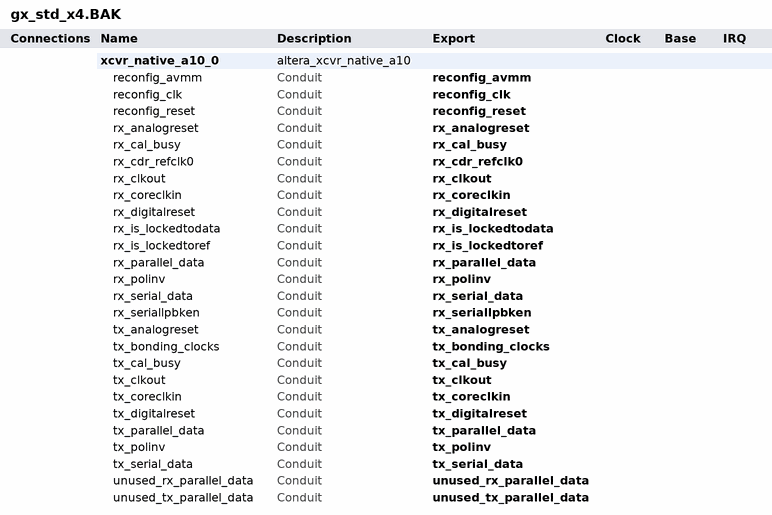
[diagram p0: system contents]
# Platform Designer (Qsys) system gx_std_x4.BAK, Arria 10 10AX115S4F45I3SGE2
# Parameters at their usual value, and those the tool derives, are not listed.
package require -exact qsys 15.1
create_system gx_std_x4.BAK
set_project_property DEVICE_FAMILY {Arria 10}
set_project_property DEVICE 10AX115S4F45I3SGE2

add_instance xcvr_native_a10_0 altera_xcvr_native_a10 15.1
set_instance_property xcvr_native_a10_0 AUTO_EXPORT true
set_instance_parameter_value xcvr_native_a10_0 anlg_voltage 1_1V
set_instance_parameter_value xcvr_native_a10_0 base_device NIGHTFURY5
set_instance_parameter_value xcvr_native_a10_0 bonded_mode pma_pcs
set_instance_parameter_value xcvr_native_a10_0 channels 4
set_instance_parameter_value xcvr_native_a10_0 enable_port_rx_analog_reset_ack 0
set_instance_parameter_value xcvr_native_a10_0 enable_port_rx_enh_bitslip 0
set_instance_parameter_value xcvr_native_a10_0 enable_port_rx_enh_blk_lock 0
set_instance_parameter_value xcvr_native_a10_0 enable_port_rx_enh_clr_errblk_count 0
set_instance_parameter_value xcvr_native_a10_0 enable_port_rx_enh_data_valid 0
set_instance_parameter_value xcvr_native_a10_0 enable_port_rx_enh_fifo_full 0
set_instance_parameter_value xcvr_native_a10_0 enable_port_rx_enh_fifo_rd_en 0
set_instance_parameter_value xcvr_native_a10_0 enable_port_rx_pma_clkout 0
set_instance_parameter_value xcvr_native_a10_0 enable_port_rx_pma_div_clkout 0
set_instance_parameter_value xcvr_native_a10_0 enable_port_rx_polinv 1
set_instance_parameter_value xcvr_native_a10_0 enable_port_rx_seriallpbken_tx 1
set_instance_parameter_value xcvr_native_a10_0 enable_port_rx_std_bitslip 0
set_instance_parameter_value xcvr_native_a10_0 enable_port_tx_analog_reset_ack 0
set_instance_parameter_value xcvr_native_a10_0 enable_port_tx_enh_fifo_full 0
set_instance_parameter_value xcvr_native_a10_0 enable_port_tx_enh_fifo_pfull 0
set_instance_parameter_value xcvr_native_a10_0 enable_port_tx_pma_clkout 0
set_instance_parameter_value xcvr_native_a10_0 enable_port_tx_pma_div_clkout 0
set_instance_parameter_value xcvr_native_a10_0 enable_port_tx_polinv 1
set_instance_parameter_value xcvr_native_a10_0 enable_ports_rx_manual_cdr_mode 0
set_instance_parameter_value xcvr_native_a10_0 enable_simple_interface 1
set_instance_parameter_value xcvr_native_a10_0 enh_pcs_pma_width 40
set_instance_parameter_value xcvr_native_a10_0 enh_pld_pcs_width 40
set_instance_parameter_value xcvr_native_a10_0 enh_rx_blksync_enable 0
set_instance_parameter_value xcvr_native_a10_0 enh_rx_descram_enable 0
set_instance_parameter_value xcvr_native_a10_0 enh_rxfifo_mode {Phase compensation}
set_instance_parameter_value xcvr_native_a10_0 enh_tx_scram_enable 0
set_instance_parameter_value xcvr_native_a10_0 enh_tx_scram_seed 0
set_instance_parameter_value xcvr_native_a10_0 enh_txfifo_mode {Phase compensation}
set_instance_parameter_value xcvr_native_a10_0 generate_add_hdl_instance_example 0
set_instance_parameter_value xcvr_native_a10_0 generate_docs 1
set_instance_parameter_value xcvr_native_a10_0 protocol_mode basic_std
set_instance_parameter_value xcvr_native_a10_0 rapid_validate 0
set_instance_parameter_value xcvr_native_a10_0 rcfg_file_prefix altera_xcvr_native_a10
set_instance_parameter_value xcvr_native_a10_0 rcfg_h_file_enable 0
set_instance_parameter_value xcvr_native_a10_0 rcfg_iface_enable 0
set_instance_parameter_value xcvr_native_a10_0 rcfg_jtag_enable 1
set_instance_parameter_value xcvr_native_a10_0 rcfg_mif_file_enable 0
set_instance_parameter_value xcvr_native_a10_0 rcfg_multi_enable 0
set_instance_parameter_value xcvr_native_a10_0 rcfg_profile_cnt 2
set_instance_parameter_value xcvr_native_a10_0 rcfg_profile_select 1
set_instance_parameter_value xcvr_native_a10_0 rcfg_reduced_files_enable 0
set_instance_parameter_value xcvr_native_a10_0 rcfg_separate_avmm_busy 0
set_instance_parameter_value xcvr_native_a10_0 rcfg_shared 1
set_instance_parameter_value xcvr_native_a10_0 rcfg_sv_file_enable 0
set_instance_parameter_value xcvr_native_a10_0 rx_pma_div_clkout_divider 0
set_instance_parameter_value xcvr_native_a10_0 set_capability_reg_enable 1
set_instance_parameter_value xcvr_native_a10_0 set_cdr_refclk_freq 240.000000
set_instance_parameter_value xcvr_native_a10_0 set_csr_soft_logic_enable 1
set_instance_parameter_value xcvr_native_a10_0 set_data_rate 4800
set_instance_parameter_value xcvr_native_a10_0 set_disconnect_analog_resets 0
set_instance_parameter_value xcvr_native_a10_0 set_odi_soft_logic_enable 1
set_instance_parameter_value xcvr_native_a10_0 set_prbs_soft_logic_enable 1
set_instance_parameter_value xcvr_native_a10_0 std_pcs_pma_width 20
set_instance_parameter_value xcvr_native_a10_0 std_rx_8b10b_enable 0
set_instance_parameter_value xcvr_native_a10_0 std_rx_byte_deser_mode Disabled
set_instance_parameter_value xcvr_native_a10_0 std_rx_polinv_enable 1
set_instance_parameter_value xcvr_native_a10_0 std_rx_word_aligner_mode bitslip
set_instance_parameter_value xcvr_native_a10_0 std_rx_word_aligner_pattern_len 7
set_instance_parameter_value xcvr_native_a10_0 std_tx_8b10b_enable 0
set_instance_parameter_value xcvr_native_a10_0 std_tx_byte_ser_mode Disabled
set_instance_parameter_value xcvr_native_a10_0 std_tx_polinv_enable 1
set_instance_parameter_value xcvr_native_a10_0 tx_pma_div_clkout_divider 0

# exported interfaces
add_interface reconfig_avmm conduit end
set_interface_property reconfig_avmm EXPORT_OF xcvr_native_a10_0.reconfig_avmm
add_interface reconfig_clk conduit end
set_interface_property reconfig_clk EXPORT_OF xcvr_native_a10_0.reconfig_clk
add_interface reconfig_reset conduit end
set_interface_property reconfig_reset EXPORT_OF xcvr_native_a10_0.reconfig_reset
add_interface rx_analogreset conduit end
set_interface_property rx_analogreset EXPORT_OF xcvr_native_a10_0.rx_analogreset
add_interface rx_cal_busy conduit end
set_interface_property rx_cal_busy EXPORT_OF xcvr_native_a10_0.rx_cal_busy
add_interface rx_cdr_refclk0 conduit end
set_interface_property rx_cdr_refclk0 EXPORT_OF xcvr_native_a10_0.rx_cdr_refclk0
add_interface rx_clkout conduit end
set_interface_property rx_clkout EXPORT_OF xcvr_native_a10_0.rx_clkout
add_interface rx_coreclkin conduit end
set_interface_property rx_coreclkin EXPORT_OF xcvr_native_a10_0.rx_coreclkin
add_interface rx_digitalreset conduit end
set_interface_property rx_digitalreset EXPORT_OF xcvr_native_a10_0.rx_digitalreset
add_interface rx_is_lockedtodata conduit end
set_interface_property rx_is_lockedtodata EXPORT_OF xcvr_native_a10_0.rx_is_lockedtodata
add_interface rx_is_lockedtoref conduit end
set_interface_property rx_is_lockedtoref EXPORT_OF xcvr_native_a10_0.rx_is_lockedtoref
add_interface rx_parallel_data conduit end
set_interface_property rx_parallel_data EXPORT_OF xcvr_native_a10_0.rx_parallel_data
add_interface rx_polinv conduit end
set_interface_property rx_polinv EXPORT_OF xcvr_native_a10_0.rx_polinv
add_interface rx_serial_data conduit end
set_interface_property rx_serial_data EXPORT_OF xcvr_native_a10_0.rx_serial_data
add_interface rx_seriallpbken conduit end
set_interface_property rx_seriallpbken EXPORT_OF xcvr_native_a10_0.rx_seriallpbken
add_interface tx_analogreset conduit end
set_interface_property tx_analogreset EXPORT_OF xcvr_native_a10_0.tx_analogreset
add_interface tx_bonding_clocks conduit end
set_interface_property tx_bonding_clocks EXPORT_OF xcvr_native_a10_0.tx_bonding_clocks
add_interface tx_cal_busy conduit end
set_interface_property tx_cal_busy EXPORT_OF xcvr_native_a10_0.tx_cal_busy
add_interface tx_clkout conduit end
set_interface_property tx_clkout EXPORT_OF xcvr_native_a10_0.tx_clkout
add_interface tx_coreclkin conduit end
set_interface_property tx_coreclkin EXPORT_OF xcvr_native_a10_0.tx_coreclkin
add_interface tx_digitalreset conduit end
set_interface_property tx_digitalreset EXPORT_OF xcvr_native_a10_0.tx_digitalreset
add_interface tx_parallel_data conduit end
set_interface_property tx_parallel_data EXPORT_OF xcvr_native_a10_0.tx_parallel_data
add_interface tx_polinv conduit end
set_interface_property tx_polinv EXPORT_OF xcvr_native_a10_0.tx_polinv
add_interface tx_serial_data conduit end
set_interface_property tx_serial_data EXPORT_OF xcvr_native_a10_0.tx_serial_data
add_interface unused_rx_parallel_data conduit end
set_interface_property unused_rx_parallel_data EXPORT_OF xcvr_native_a10_0.unused_rx_parallel_data
add_interface unused_tx_parallel_data conduit end
set_interface_property unused_tx_parallel_data EXPORT_OF xcvr_native_a10_0.unused_tx_parallel_data

set_interconnect_requirement {$system} qsys_mm.clockCrossingAdapter HANDSHAKE
set_interconnect_requirement {$system} qsys_mm.enableEccProtection FALSE
set_interconnect_requirement {$system} qsys_mm.insertDefaultSlave FALSE
set_interconnect_requirement {$system} qsys_mm.maxAdditionalLatency 1

save_system gx_std_x4.BAK.qsys
